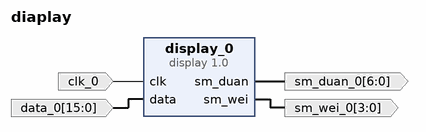
[diagram p0: block diagram of the top level]
# Vivado block design diaplay, xc7a35tcpg236-1, Vivado 2019.2
create_bd_design diaplay

create_bd_port -dir I -type clk clk_0
create_bd_port -dir I -from 15 -to 0 data_0
create_bd_port -dir O -from 3 -to 0 sm_wei_0
create_bd_port -dir O -from 6 -to 0 sm_duan_0

create_bd_cell -type ip -vlnv xilinx.com:user:display:1.0 display_0

# ---- connections ----

connect_bd_net -net clk_0_1 [get_bd_ports clk_0] [get_bd_pins display_0/clk]
connect_bd_net -net data_0_1 [get_bd_ports data_0] [get_bd_pins display_0/data]
connect_bd_net [get_bd_pins display_0/sm_wei] [get_bd_ports sm_wei_0]
connect_bd_net [get_bd_pins display_0/sm_duan] [get_bd_ports sm_duan_0]

validate_bd_design
save_bd_design
